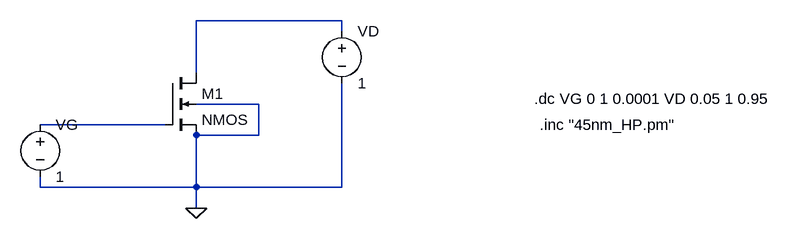
[diagram p0: schematic 45n_IDVG.asc]
45n_IDVG.asc, the LTspice schematic file:
Version 4
SHEET 1 1144 680
WIRE 464 16 240 16
WIRE 464 32 464 16
WIRE 240 96 240 16
WIRE 336 144 240 144
WIRE 192 176 0 176
WIRE 336 192 336 144
WIRE 336 192 240 192
WIRE 0 272 0 256
WIRE 240 272 240 192
WIRE 240 272 0 272
WIRE 464 272 464 112
WIRE 464 272 240 272
WIRE 240 304 240 272
FLAG 240 304 0
SYMBOL nmos4 192 96 R0
SYMATTR InstName M1
SYMATTR Value2 l=45n w=90n
SYMBOL voltage 0 160 R0
WINDOW 123 0 0 Left 0
WINDOW 39 0 0 Left 0
SYMATTR InstName VG
SYMATTR Value 1
SYMBOL voltage 464 16 R0
WINDOW 123 0 0 Left 0
WINDOW 39 0 0 Left 0
SYMATTR InstName VD
SYMATTR Value 1
TEXT 760 136 Left 2 !.dc VG 0 1 0.0001 VD 0.05 1 0.95
TEXT 768 176 Left 2 !.inc "45nm_HP.pm"

The netlist it stands for:
* 45n_IDVG.asc
M1 N001 N002 0 0 NMOS l=45n w=90n
VG N002 0 1
VD N001 0 1
.model NMOS NMOS
.model PMOS PMOS
.lib standard.mos
.dc VG 0 1 0.0001 VD 0.05 1 0.95
.inc "45nm_HP.pm"
.backanno
.end